# EAGLE schematic LPmini-Prototype_1.3_bga (EAGLE 6.4)
COMPANY: ADAFRUIT INDUSTRIES; DRAWN: KTOWN; REV: B
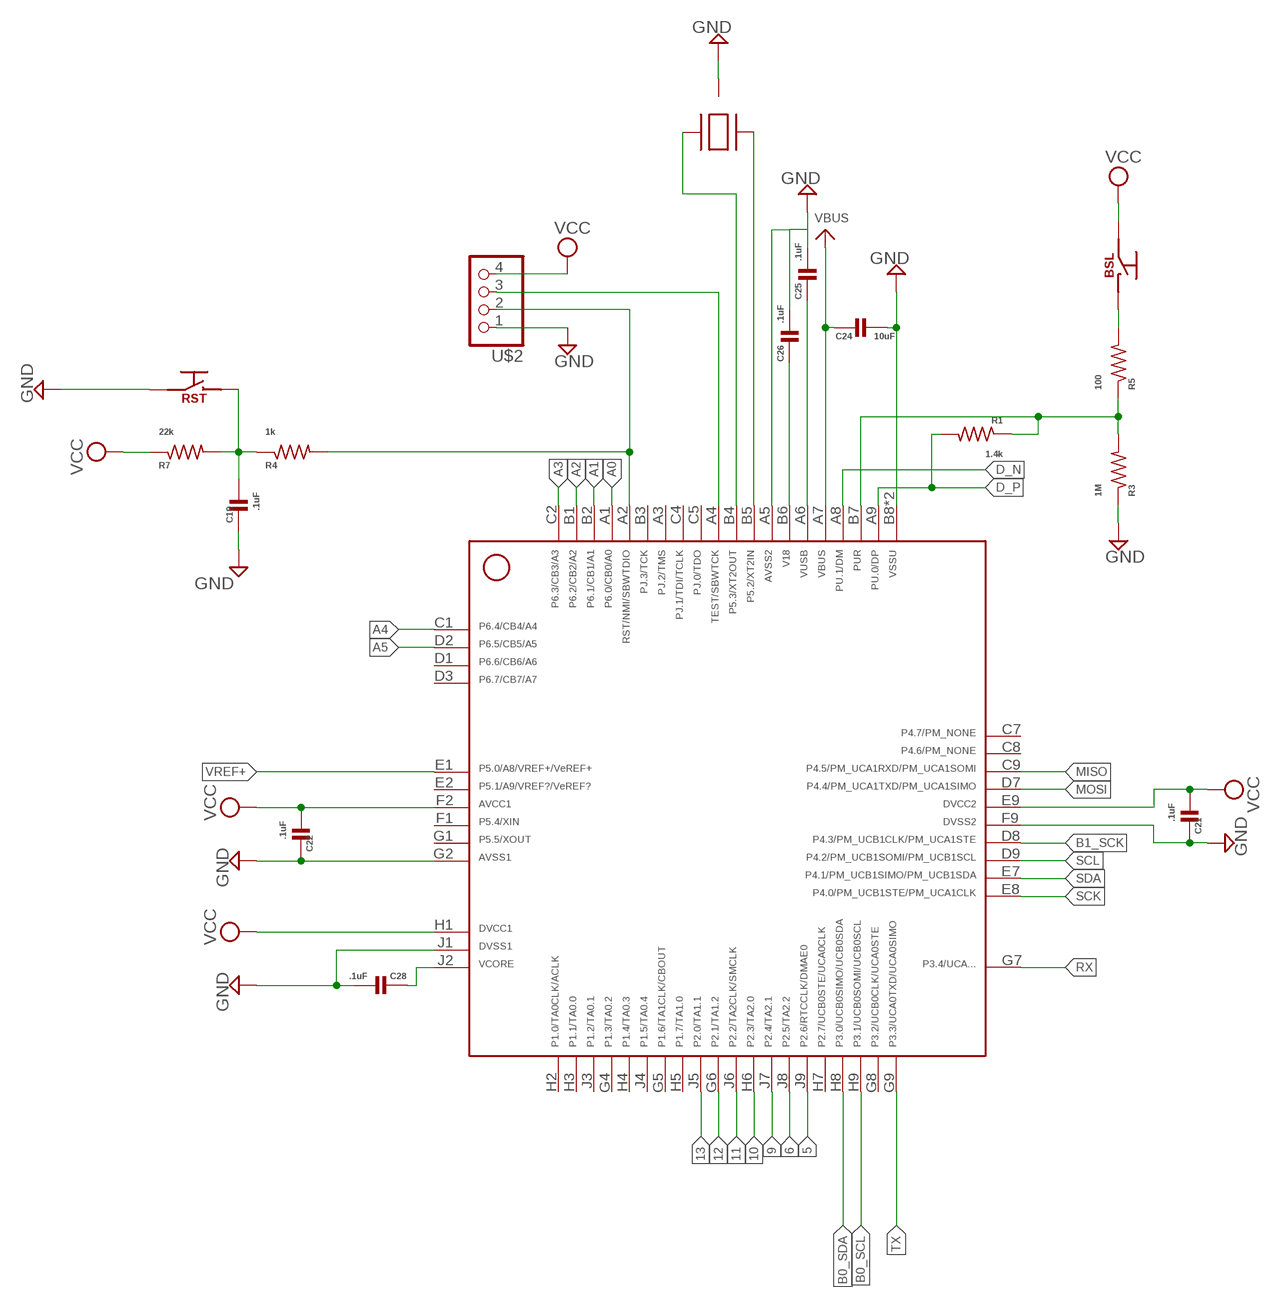
[diagram p0: schematic, sheet 1, part 1 of 2]
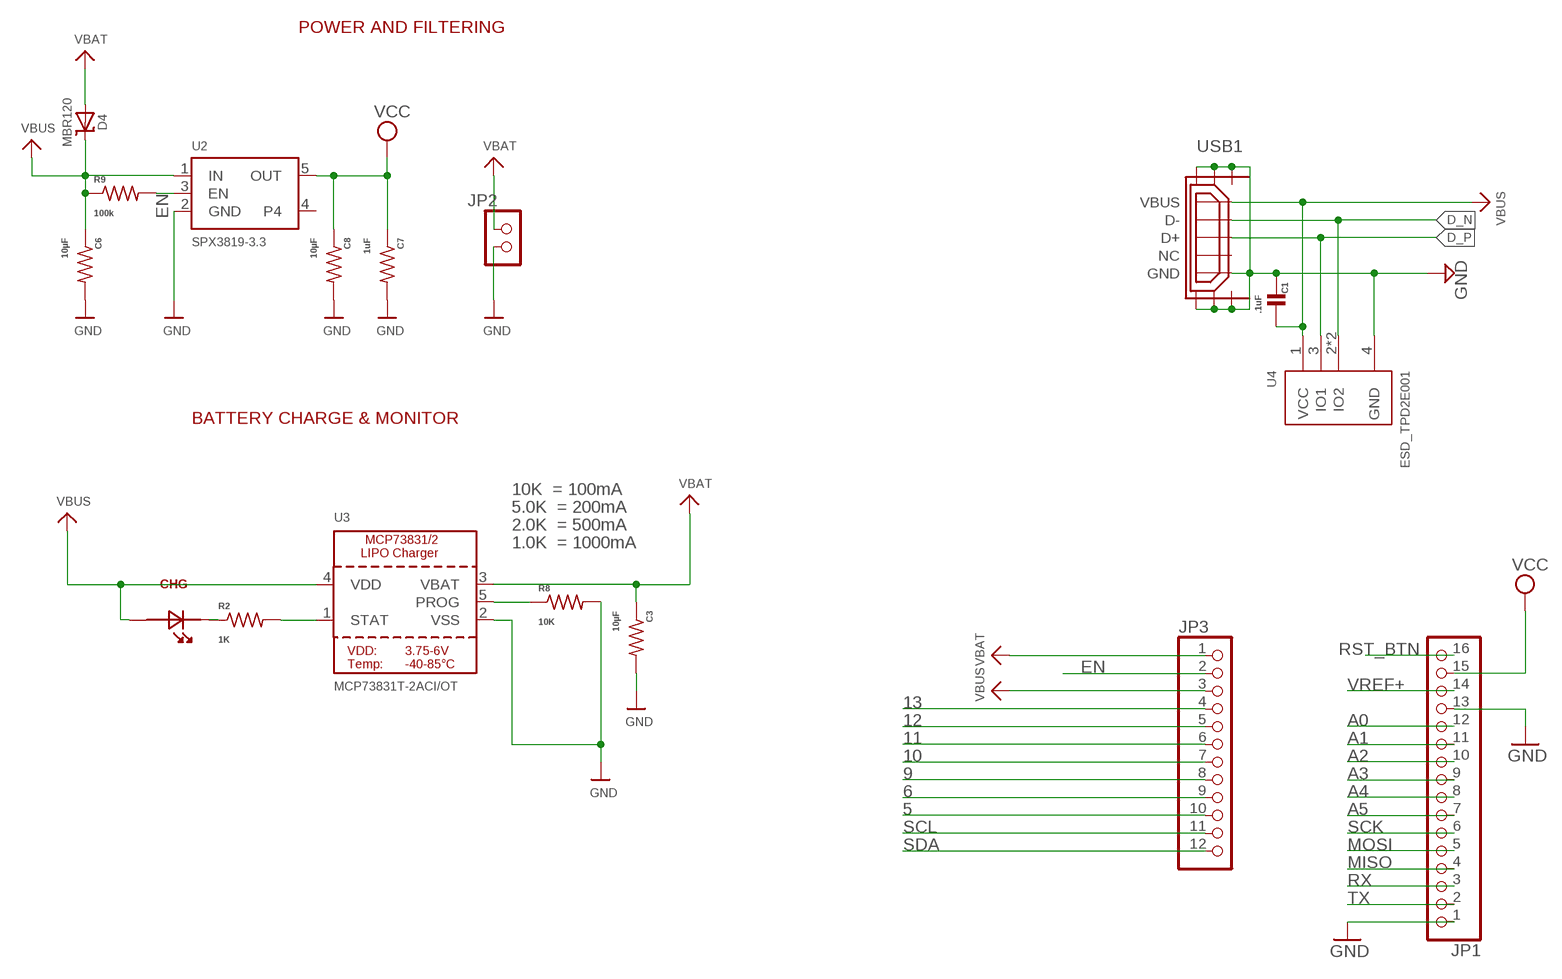
[diagram p1: schematic, sheet 1, part 2 of 2]

## Parts
BSL  PB_SMALL_SMD  [PB_KMR2]
C1  .1uF  C-EUC0402  [C0402]
C3  10µF  R-US_R0603  [R0603]
C6  10µF  R-US_R0603  [R0603]
C7  1uF  R-US_R0402  [R0402]
C8  10µF  R-US_R0603  [R0603]
C19  .1uF  C-EUC0402  [C0402]
C21  .1uF  C-EUC0402  [C0402]
C22  .1uF  C-EUC0402  [C0402]
C24  10uF  C-EUC0603  [C0603]
C25  .1uF  C-EUC0402  [C0402]
C26  .1uF  C-EUC0402  [C0402]
C28  .1uF  C-EUC0402  [C0402]
CHG  ORANGE  LED0603  [LED_0603]
D4  MBR120  DIODE-SCHOTTKYSOD-123  [SOD-123]
JP1  HEADER-1X16ROUND  [1X16_ROUND]
JP2  0_JOSEPH_PINHD-1X2END  [0_JOSEPH_1X02-END]
JP3  HEADER-1X12  [1X12_ROUND]
R1  1.4k  R-US_R0402  [R0402]
R2  1K  R-US_R0402  [R0402]
R3  1M  R-US_R0402  [R0402]
R4  1k  R-US_R0402  [R0402]
R5  100  R-US_R0402  [R0402]
R7  22k  R-US_R0402  [R0402]
R8  10K  R-US_R0402  [R0402]
R9  100k  R-US_R0402  [R0402]
RST  PB_SMALL_SMD  [PB_KMR2]
U2  SPX3819-3.3  VREG_SOT23-5  [SOT23-5]
U3  MCP73831T-2ACI/OT  MCP73831/2  [SOT23-5]
U4  ESD_TPD2E001  [PROJECT7264_TPD2E001-DRL]
U$2  PINHD_1X4MOLEX_4_1MM  [MOLEX_4_1MM]
U$4  MSP430F5528  [80_BGA_MICROSTAR]
U$5  CRYSTAL_SMD  [SMD_CRYSTAL]
USB1  USB_CON-UPDATE_USB_MICRO_FLIPPED  [USB_CON-UPDATE_HIROSE-ZX62R-B-5P]

## Nets
5: JP3.10 U$4.J9
6: JP3.9 U$4.J8
9: JP3.8 U$4.J7
10: JP3.7 U$4.H6
11: JP3.6 U$4.J6
12: JP3.5 U$4.G6
13: JP3.4 U$4.J5
A0: JP1.12 U$4.A1
A1: JP1.11 U$4.B2
A2: JP1.10 U$4.B1
A3: JP1.9 U$4.C2
A4: JP1.8 U$4.C1
A5: JP1.7 U$4.D2
B0_SCL: U$4.H9
B0_SDA: U$4.H8
B1_SCK: U$4.D8
D_N: U4.2(IO2) U4.5(IO2) U$4.A8 USB1.D-
D_P: R1.2 U4.3(IO1) U$4.A9 USB1.D+
EN: JP3.2 R9.2 U2.3(EN)
GND: C1.2 C3.2 C6.2 C7.2 C8.2 C19.2 C21.2 C22.2 C24.2 C25.2 C26.2 C28.2 JP1.1 JP1.13 JP2.2 R3.1 R8.2 RST.1A(A) RST.1B(A) U2.2(GND) U3.2(VSS) U4.4(GND) U$2.1 U$4.A5 U$4.B8(B8,B9) U$4.B9(B8,B9) U$4.F9 U$4.G2 U$4.J1 U$5.2(GND) U$5.4(GND) USB1.GND USB1.SHIELD1 USB1.SHIELD2 USB1.SHIELD3 USB1.SHIELD4 USB1.SHIELD5 USB1.SHIELD6
MISO: JP1.4 U$4.C9
MOSI: JP1.5 U$4.D7
N$1: CHG.K(C) R2.1
N$3: R2.2 U3.1(STAT)
N$4: R8.1 U3.5(PROG)
N$5: BSL.2A(B) BSL.2B(B) R5.2
N$6: R1.1 R3.2 R5.1 U$4.B7
N$11: U$2.3 U$4.A4
N$12: U$4.B5 U$5.1
N$14: U$4.B4 U$5.3
N$23: C25.1 U$4.A6
N$24: C26.1 U$4.B6
N$25: C28.1 U$4.J2
RST: R4.2 U$2.2 U$4.A2
RST_BTN: C19.1 JP1.16 R4.1 R7.2 RST.2A(B) RST.2B(B)
RX: JP1.3 U$4.G7
SCK: JP1.6 U$4.E8
SCL: JP3.11 U$4.D9
SDA: JP3.12 U$4.E7
TX: JP1.2 U$4.G9
VBAT: C3.1 D4.A JP2.1 JP3.1 U3.3(VBAT)
VBUS: C1.1 C6.1 C24.1 CHG.A D4.C JP3.3 R9.1 U2.1(IN) U3.4(VDD) U4.1(VCC) U$4.A7 USB1.VBUS
VCC: BSL.1A(A) BSL.1B(A) C7.1 C8.1 C21.1 C22.1 JP1.15 R7.1 U2.5(OUT) U$2.4 U$4.E9 U$4.F2 U$4.H1
VREF+: JP1.14 U$4.E1
Unconnected: U2.4 U$4.A3 U$4.B3 U$4.C4 U$4.C5 U$4.C7 U$4.C8 U$4.D1 U$4.D3 U$4.E2 U$4.F1 U$4.G1 U$4.G4 U$4.G5 U$4.G8 U$4.H2 U$4.H3 U$4.H4 U$4.H5 U$4.H7 U$4.J3 U$4.J4 USB1.NC

## Notes on the sheet
- POWER AND FILTERING
- BATTERY CHARGE & MONITOR
- 10K  = 100mA
- 5.0K  = 200mA
- 2.0K  = 500mA
- 1.0K  = 1000mA

## Library data of the parts
BSL RST = 0Joseph:PB_SMALL_SMD
C1 C19 C21 C22 C24-C26 C28 = rcl:C-EU: CAPACITOR, European symbol
C3 C6-C8 R1-R5 R7-R9 = rcl:R-US_: RESISTOR, American symbol
CHG = 0Joseph:LED
D4 = microbuilder:DIODE-SCHOTTKY
JP1 = microbuilder:HEADER-1X16: PIN HEADER
JP2 = 0Joseph:0_JOSEPH_PINHD-1X2: PIN HEADER
JP3 = microbuilder:HEADER-1X12
U2 = microbuilder:VREG_SOT23-5: SOT23-5 Fixed Voltage Regulators Part Current Out V Out V In V Dropout θJA (°C/W) TJ (°C) Digikey Part No. ADP121 150mA 3.3V 3.4-5.5V 0.09V @ 150mA -- -- ADP121-AUJZ33R7CT-ND ADP121 150mA 3.0V 3.1-5.5V 0.09V @ 150mA -- -- ADP121-AUJZ30R7CT-ND ADP122 300mA 3.3V 3.4-5.5V 0.085V @ 300mA -- -- ADP122AUJZ-3.3-R7CT-ND ADP1712 300mA 3.3V 3.5-5.5V 0.17V @ 300mA -- -- ADP1712AUJZ-3.3-R7TR-ND AP7311 (Low Cost) 150mA 3.3V 3.5-6V 0.15V @ 150mA -- -- AP7311-33WG-7DICT-ND LD39015M18R 150mA 1.8V 1.9V-5.5V 0.08V @ 100mA -- -- 497-6977-1-ND LP2985A-33DBVR 150mA 3.3V 3.3-16V 0.28V @ 150mA 206 150 296-18479-1-ND MCP1824T-3302E/OT 300mA 3.3V 3.5V-6V 0.2V @ 300mA -- -- MCP1824T-3302E/OTCT-ND MIC5205-2.5YM5 TR 150mA 2.5V 2.7-16V 0.165V @ 150mA -- -- 576-1257-2-ND MIC5205-3.0YM5 TR 150mA 3.0V 3.2V-16V 0.165V @ 150mA -- -- 576-1258-2-ND MIC5205-3.3YM5 TR 150mA 3.3V 3.5V-16V 0.165V @ 150mA -- -- 576-1259-2-ND TPS780330220 150mA 3.3V+2.2V 3.6-5.5V 250mV Max -- -- 296-23332-1-ND TDA3663/N1,135 100mA 3.3V 3.5-45V 0.18V @ 50mA -- -- 568-5343-1-ND Max operating temp can be calculated using θJA, TJ (max junction temperature), and power in watts. Set the "Maximum Ambient Temperature" until it reaches TJ ("Max Junction Temperature"), which is the absolute limit for safe use of the regulator: Heat Sink Temperature Calculator <http://www.daycounter.com/Calculators/Heat-Sink-Temperature-Calculator.phtml> For example, With 12V source into a 3.3V LP2985 and a 30mA load, we are dissipating (12V-3.3V) * 0.03A = 0.261W. With a θJA of 206 °C/W, a TJ of 150°C, and 261mW we can safely use the chip without a heat sink up to 75°C (=147.1°C Junction Temperature).
U3 = microbuilder:MCP73831/2: MCP73831/2 LIPO Charger VDD: 3.75 - 6V Temp -40 - 85°C Programmable Charge Rate: 15-500mA NOTE: STAT is a tri-state logic output on the MCP73831 and an open-drain output on the MCP73832. SOT23-5 with 4.2V output and tri-state logic on STAT = MCP73831T-2ACI/OT
U4 = 0Joseph:ESD_TPD2E001: TPD2E001 ESD-protection diode array
U$2 = 0Joseph:PINHD_1X4
U$4 = 0Joseph:MSP430F5528
U$5 = 0Joseph:CRYSTAL_SMD
USB1 = 0Joseph:USB_CON-UPDATE_USB_MICRO_FLIPPED